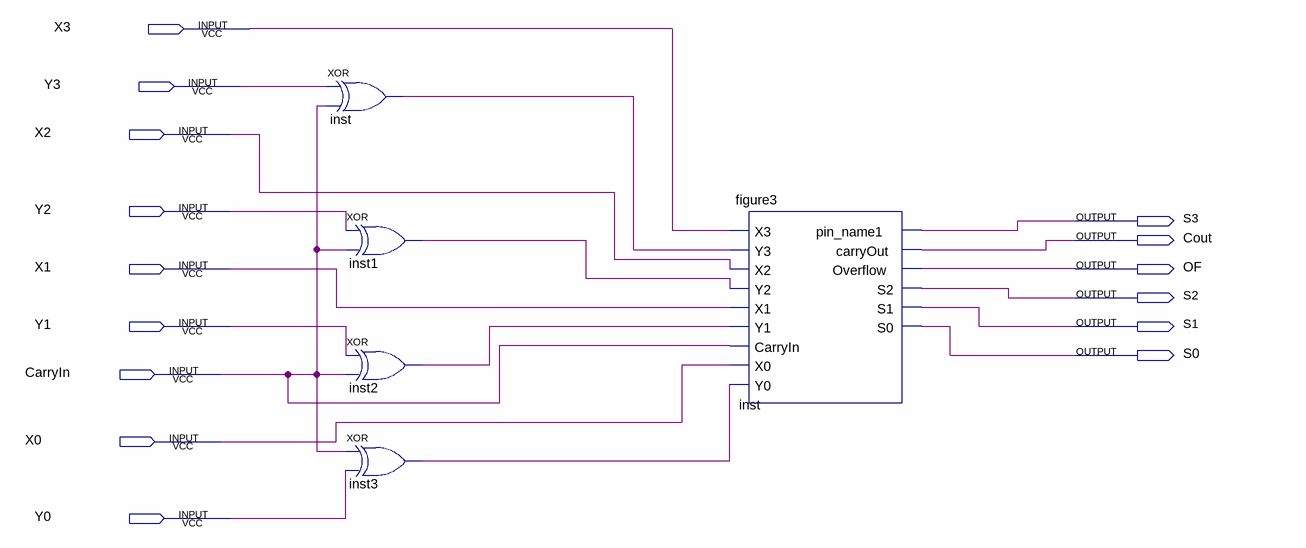
[diagram p0: schematic sheet]
// Quartus schematic Block1.bdf as structural Verilog: 5 symbols, 15 pins
module Block1 (
  input  X3,
  input  Y3,
  input  X2,
  input  Y2,
  input  X1,
  input  Y1,
  input  CarryIn,
  input  X0,
  input  Y0,
  output S3,
  output Cout,
  output OF,
  output S2,
  output S1,
  output S0
);

  wire inst1_out, inst2_out, inst3_out, inst_out;

  xor inst (inst_out, Y3, CarryIn);
  xor inst1 (inst1_out, Y2, CarryIn);
  xor inst2 (inst2_out, Y1, CarryIn);
  xor inst3 (inst3_out, CarryIn, Y0);
  figure3 inst_dup2 (
    .X3(X3), .Y3(inst_out), .X2(X2), .Y2(inst1_out), .X1(X1), .Y1(inst2_out), .CarryIn(CarryIn), .X0(X0),
    .Y0(inst3_out), .pin_name1(S3), .carryOut(Cout), .Overflow(OF), .S2(S2), .S1(S1), .S0(S0));
endmodule
